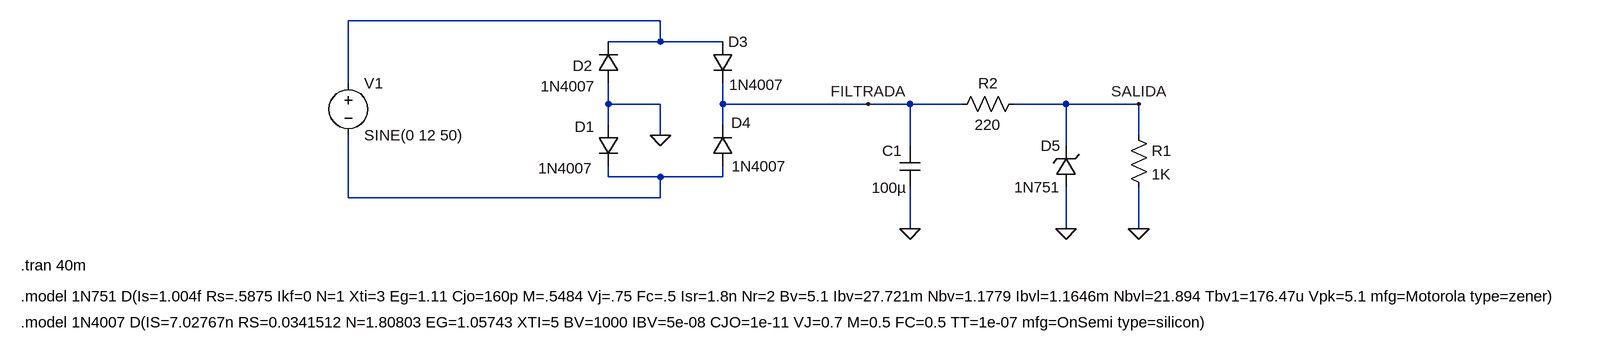
[diagram p0: schematic diodo-puente-rectificador-terceros.asc]
diodo-puente-rectificador-terceros.asc, the LTspice schematic file:
Version 4
SHEET 1 2764 680
WIRE 1328 -32 848 -32
WIRE 1328 0 1328 -32
WIRE 1328 0 1248 0
WIRE 1424 0 1328 0
WIRE 848 64 848 -32
WIRE 1248 96 1248 64
WIRE 1328 96 1248 96
WIRE 1424 96 1424 64
WIRE 1648 96 1424 96
WIRE 1712 96 1648 96
WIRE 1792 96 1712 96
WIRE 1952 96 1872 96
WIRE 2064 96 1952 96
WIRE 1248 128 1248 96
WIRE 1424 128 1424 96
WIRE 1328 144 1328 96
WIRE 2064 144 2064 96
WIRE 1712 160 1712 96
WIRE 1952 160 1952 96
WIRE 1248 208 1248 192
WIRE 1328 208 1248 208
WIRE 1424 208 1424 192
WIRE 1424 208 1328 208
WIRE 848 240 848 144
WIRE 1328 240 1328 208
WIRE 1328 240 848 240
WIRE 1712 288 1712 224
WIRE 1952 288 1952 224
WIRE 2064 288 2064 224
FLAG 2064 288 0
FLAG 2064 96 SALIDA
FLAG 1328 144 0
FLAG 1712 288 0
FLAG 1952 288 0
FLAG 1648 96 FILTRADA
SYMBOL diode 1232 128 R0
WINDOW 0 -36 3 Left 2
WINDOW 3 206 64 Left 2
SYMATTR InstName D1
SYMATTR Value 1N4007
SYMBOL voltage 848 48 R0
WINDOW 123 0 0 Left 0
WINDOW 39 0 0 Left 0
SYMATTR InstName V1
SYMATTR Value SINE(0 12 50)
SYMBOL res 2048 128 R0
SYMATTR InstName R1
SYMATTR Value 1K
SYMBOL diode 1264 64 R180
WINDOW 0 40 27 Left 2
WINDOW 3 35 -5 Left 2
SYMATTR InstName D2
SYMATTR Value 1N4007
SYMBOL diode 1408 0 R0
WINDOW 3 26 66 Left 2
SYMATTR Value 1N4007
SYMATTR InstName D3
SYMBOL diode 1440 192 R180
WINDOW 0 -28 67 Left 2
WINDOW 3 215 -3 Left 2
SYMATTR InstName D4
SYMATTR Value 1N4007
SYMBOL cap 1696 160 R0
WINDOW 0 -27 8 Left 2
WINDOW 3 -43 65 Left 2
SYMATTR InstName C1
SYMATTR Value 100µ
SYMBOL res 1888 80 R90
WINDOW 0 0 56 VBottom 2
WINDOW 3 32 56 VTop 2
SYMATTR InstName R2
SYMATTR Value 220
SYMBOL zener 1968 224 R180
WINDOW 0 24 64 Left 2
WINDOW 3 24 0 Left 2
SYMATTR InstName D5
SYMATTR Value 1N751
SYMATTR Description Diode
SYMATTR Type diode
TEXT 344 344 Left 2 !.tran 40m
TEXT 344 392 Left 2 !.model 1N751 D(Is=1.004f Rs=.5875 Ikf=0 N=1 Xti=3 Eg=1.11 Cjo=160p M=.5484 Vj=.75 Fc=.5 Isr=1.8n Nr=2 Bv=5.1 Ibv=27.721m Nbv=1.1779 Ibvl=1.1646m Nbvl=21.894 Tbv1=176.47u Vpk=5.1 mfg=Motorola type=zener)
TEXT 344 432 Left 2 !.model 1N4007 D(IS=7.02767n RS=0.0341512 N=1.80803 EG=1.05743 XTI=5 BV=1000 IBV=5e-08 CJO=1e-11 VJ=0.7 M=0.5 FC=0.5 TT=1e-07 mfg=OnSemi type=silicon)

The netlist it stands for:
* diodo-puente-rectificador-terceros.asc
D1 0 N002 1N4007
V1 N001 N002 SINE(0 12 50)
R1 SALIDA 0 1K
D2 0 N001 1N4007
D3 N001 FILTRADA 1N4007
D4 N002 FILTRADA 1N4007
C1 FILTRADA 0 100µ
R2 SALIDA FILTRADA 220
D5 0 SALIDA 1N751
.model D D
.lib standard.dio
.tran 40m
.model 1N751 D(Is=1.004f Rs=.5875 Ikf=0 N=1 Xti=3 Eg=1.11 Cjo=160p M=.5484 Vj=.75 Fc=.5 Isr=1.8n Nr=2 Bv=5.1 Ibv=27.721m Nbv=1.1779 Ibvl=1.1646m Nbvl=21.894 Tbv1=176.47u Vpk=5.1 mfg=Motorola type=zener)
.model 1N4007 D(IS=7.02767n RS=0.0341512 N=1.80803 EG=1.05743 XTI=5 BV=1000 IBV=5e-08 CJO=1e-11 VJ=0.7 M=0.5 FC=0.5 TT=1e-07 mfg=OnSemi type=silicon)
.backanno
.end